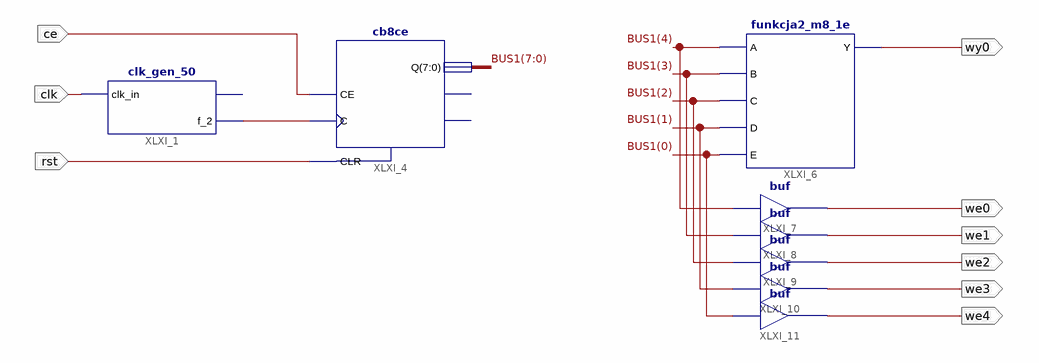
[diagram p0: schematic sheet 1]
// Xilinx ISE schematic symulacja.sch (spartan3e) as structural Verilog: 8 symbols, 9 ports
module symulacja (
  input  ce,
  input  rst,
  input  clk,
  output wy0,
  output we0,
  output we1,
  output we2,
  output we3,
  output we4
);

  wire clock;
  wire [7:0] BUS1;

  clk_gen_50 XLXI_1 (.clk_in(clk), .f_2(clock));  // open: f_1
  cb8ce XLXI_4 (.C(clock), .CE(ce), .CLR(rst), .Q(BUS1));  // open: CEO, TC
  funkcja2_m8_1e XLXI_6 (.A(BUS1[4]), .B(BUS1[3]), .C(BUS1[2]), .Y(wy0), .D(BUS1[1]), .E(BUS1[0]));
  buf XLXI_7 (we0, BUS1[4]);
  buf XLXI_8 (we1, BUS1[3]);
  buf XLXI_9 (we2, BUS1[2]);
  buf XLXI_10 (we3, BUS1[1]);
  buf XLXI_11 (we4, BUS1[0]);

  // Notes on the sheet:
  //   LOC on signal ce = R17
  //   LOC on signal rst = B18
  //   LOC on signal clk = B8
  //   LOC on signal wy0 = M16
  //   LOC on signal we0 = L15
  //   LOC on signal we1 = K12
  //   LOC on signal we2 = L17
  //   LOC on signal we3 = M15
  //   LOC on signal we4 = K13
endmodule
